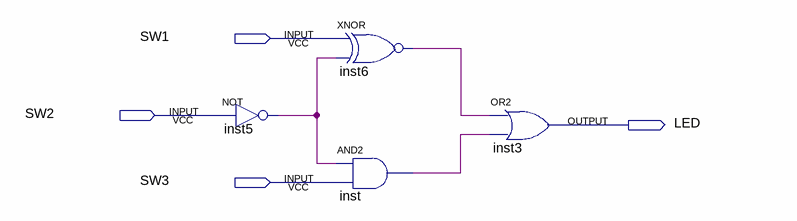
[diagram p0: schematic sheet]
// Quartus schematic Block2.bdf as structural Verilog: 4 symbols, 4 pins
module Block2 (
  input  SW1,
  input  SW2,
  input  SW3,
  output LED
);

  wire inst5_out, inst6_out, inst_out;

  not inst5 (inst5_out, SW2);
  xnor inst6 (inst6_out, SW1, inst5_out);
  and inst (inst_out, inst5_out, SW3);
  or inst3 (LED, inst6_out, inst_out);
endmodule
